# EasyEDA Pro project ProProject_007aLS_2024-05-12.epro

# Schematic Schematic1.1
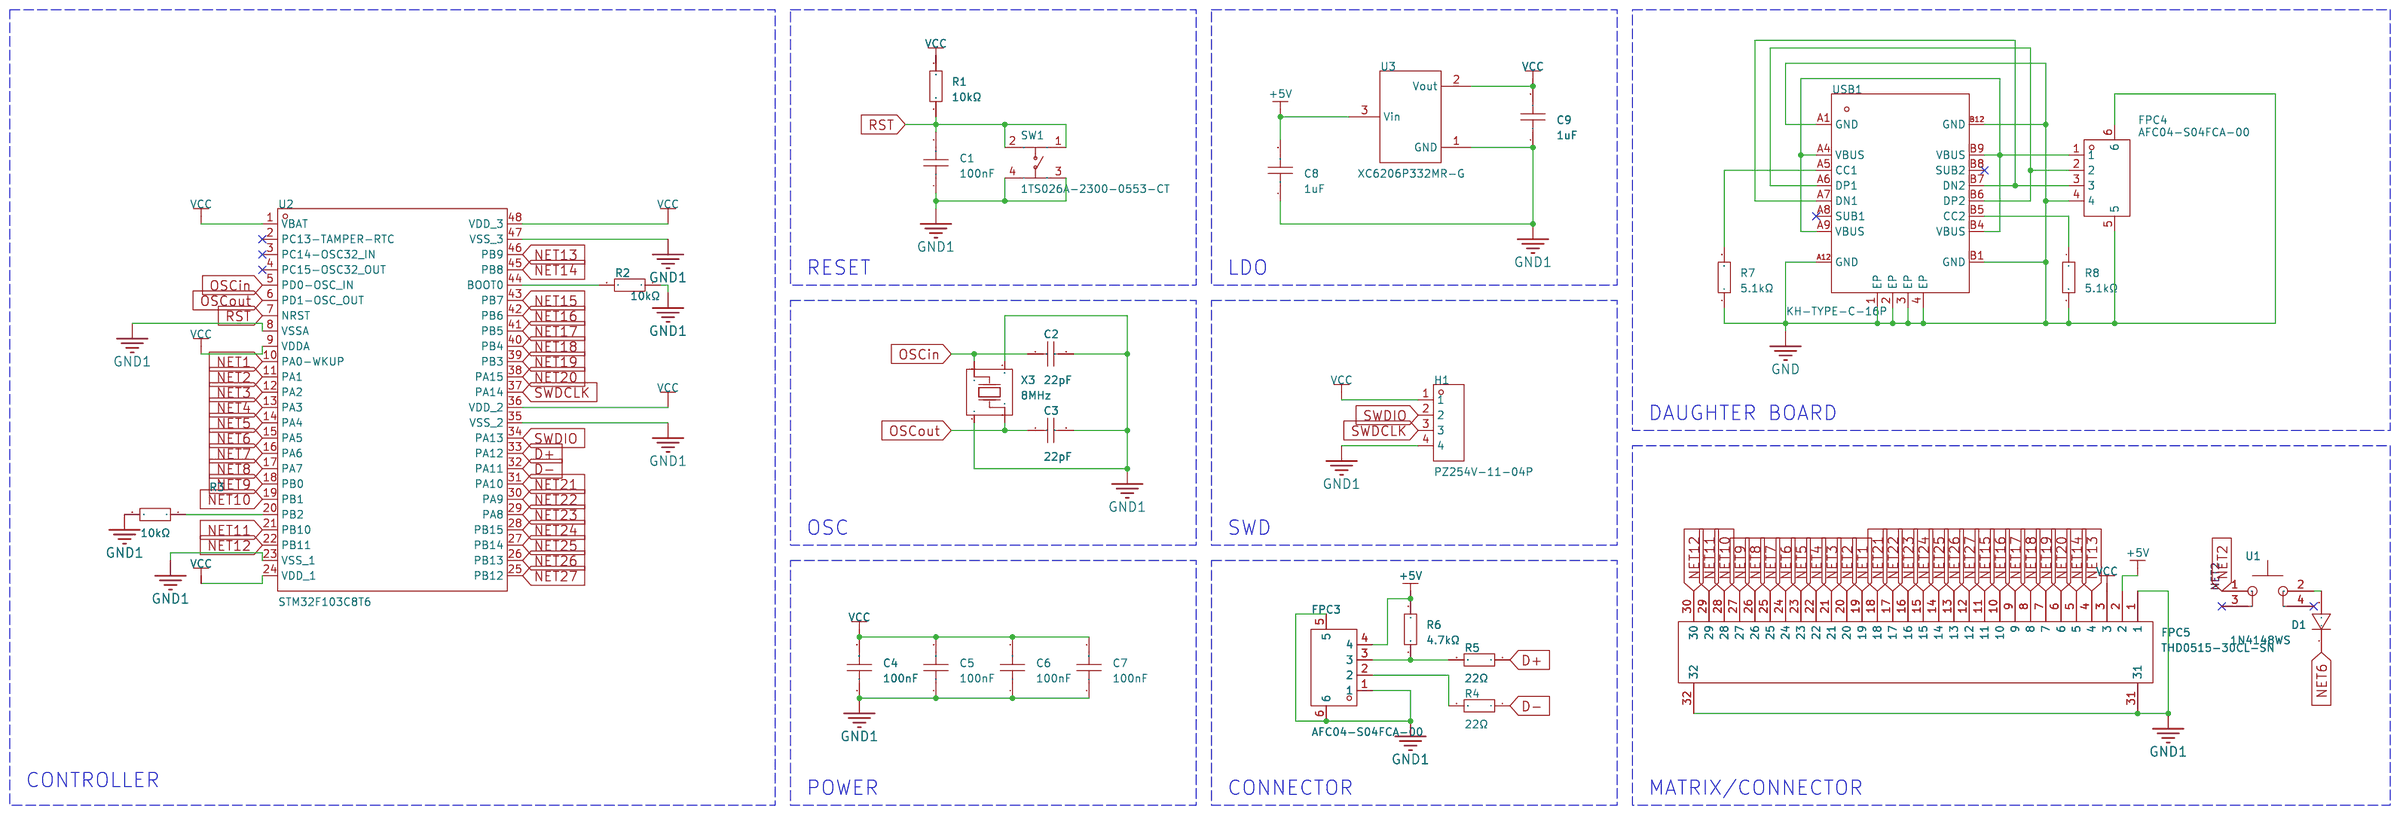
[diagram p0: schematic sheet]

## Parts
C1  100nF  [C0603]
C2  22pF  [C0603]
C3  22pF  [C0603]
C4  100nF  [C0603]
C5  100nF  [C0603]
C6  100nF  [C0603]
C7  100nF  [C0603]
C8  1uF  [C0603]
C9  1uF  [C0603]
D1  1N4148WS  [SOD-323_L1.8-W1.3-LS2.5-RD]
FPC3  AFC04-S04FCA-00  [FPC-SMD_AFC04-S04FCA-00]
FPC4  AFC04-S04FCA-00  [FPC-SMD_AFC04-S04FCA-00]
FPC5  THD0515-30CL-SN  [FFC-SMD_30P-P0.50_THD0515-30CL-SN]
H1  PZ254V-11-04P  [HDR-TH_4P-P2.54-V-M]
R1  10kΩ  [R0603]
R2  10kΩ  [R0603]
R3  10kΩ  [R0603]
R4  22Ω  [R0603]
R5  22Ω  [R0603]
R6  4.7kΩ  [R0603]
R7  5.1kΩ  [R0603]
R8  5.1kΩ  [R0603]
SW1  1TS026A-2300-0553-CT  [SW-SMD_4P-L2.6-W1.6-P0.75-LS3.0]
U1  -  [MXOnly-6.25U/7U-Hotswap-ReversedStabilizers]
U2  STM32F103C8T6  [LQFP-48_L7.0-W7.0-P0.50-LS9.0-BL]
U3  XC6206P332MR-G  [SOT-23-3_L2.9-W1.6-P1.90-LS2.8-BR]
USB1  KH-TYPE-C-16P  [USB-C-SMD_KH-TYPE-C-16P]
X3  8MHz  [OSC-SMD_4P-L3.2-W2.5-BL]

## Library data of the parts
C1 C4-C7 = CC0603KRX7R9BB104: 容值:100nF;精度:±10%;额定电压:50V;材质(温度系数):X7R;; LCSC Part Name: 100nF ±10% 50V; Supplier Part: C14663; Manufacturer: YAGEO(国巨); Supplier Footprint: 0603; JLCPCB Part Class: 基础库; Datasheet: https://atta.szlcsc.com/upload/public/pdf/source/20180910/C282072_33301C7F631E79921B82A8DAC6BCC5B3.pdf; Supplier: LCSC; Tolerance: ±10%; Voltage Rated: 50V; Temperature Coefficient: X7R
C2 C3 = CL10C220JB8NNNC: 容值:22pF;精度:±5%;额定电压:50V;材质(温度系数):C0G;; LCSC Part Name: 22pF ±5% 50V; Supplier Part: C1653; Manufacturer: SAMSUNG(三星); Supplier Footprint: 0603; JLCPCB Part Class: 基础库; Datasheet: https://atta.szlcsc.com/upload/public/pdf/source/20160218/1457707763339.pdf; Supplier: LCSC; Tolerance: ±5%; Voltage Rated: 50V; Temperature Coefficient: C0G
C8 C9 = CL10A105KB8NNNC: 容值:1uF;精度:±10%;额定电压:50V;材质(温度系数):X5R;; LCSC Part Name: 1uF ±10% 50V; Supplier Part: C15849; Manufacturer: SAMSUNG(三星); Supplier Footprint: 0603; JLCPCB Part Class: 基础库; Datasheet: https://atta.szlcsc.com/upload/public/pdf/source/20160218/1457707763339.pdf; Supplier: LCSC; Tolerance: ±10%; Voltage Rated: 50V; Temperature Coefficient: X5R
D1 = 1N4148WS_C2128: 二极管配置:独立式;正向压降(Vf):1.25V@150mA;直流反向耐压(Vr):100V;平均整流电流(Io):150mA;功率:200mW;反向恢复时间(trr):4ns;; LCSC Part Name: 电压:100V 电流:150mA; Supplier Part: C2128; Manufacturer: CJ(江苏长电/长晶); Supplier Footprint: SOD-323; JLCPCB Part Class: 基础库; Datasheet: https://atta.szlcsc.com/upload/public/pdf/source/20140809/1457707208178.pdf; Supplier: LCSC; Diode Configuration: 独立式; Forward Voltage (Vf@If): 1.25V@150mA; Reverse Voltage (Vr): 100V; Average Rectified Current (Io): 150mA; Power Dissipation: 200mW; Reverse Leakage Current: 1uA@75V; Reverse Recovery Time (trr): 4ns
FPC3 FPC4 = AFC04-S04FCA-00: 锁定特性:抽屉式;触点类型:下接;触点数量:4P;间距:0.5mm;安装类型:卧贴;工作温度范围:-25℃~+85℃;; LCSC Part Name: 间距:0.5mm P数:4P 抽屉式 下接; Supplier Part: C883623; Manufacturer: JS(钜硕电子); Supplier Footprint: SMD,P=0.5mm,卧贴; JLCPCB Part Class: 扩展库; Datasheet: https://atta.szlcsc.com/upload/public/pdf/source/20201020/C883623_C1266E0D076E1742B421A6F99EE675B6.pdf; Supplier: LCSC; Locking Feature: 抽屉式; Contact Type: 下接; Number of Contacts: 4P; Pitch: 0.5mm; Mounting Type: 卧贴; FFC, FCB Thickness: 0.3mm; Height Above Board: 1.2mm; Operating Temperature Range: -25℃~+85℃
FPC5 = THD0515-30CL-SN: 锁定特性:翻盖式;触点类型:下接;触点数量:30P;间距:0.5mm;安装类型:卧贴;; LCSC Part Name: 间距:0.5mm P数:30P 翻盖式 下接; Supplier Part: C283152; Manufacturer: THD(台华达); Supplier Footprint: SMD,P=0.5mm,卧贴; JLCPCB Part Class: 扩展库; Datasheet: https://atta.szlcsc.com/upload/public/pdf/source/20191217/C473757_20968A8B43F39FFA96CE4CB8A2D46C0F.pdf; Supplier: LCSC; Locking Feature: 翻盖式; Contact Type: 下接; Number of Contacts: 30P; Pitch: 0.5mm; Mounting Type: 卧贴; FFC, FCB Thickness: 0.3mm; Height Above Board: 1.5mm
H1 = PZ254V-11-04P: 插针结构:1x4P;间距:2.54mm;行距:-;圆针/方针:方针;安装类型:直插;排数:单排;总PIN位数:4P;额定电流:3A;额定电压:250V;配合针长度:6mm;塑高:2.5mm;端接针长度:3mm;触头材质:-;工作温度范围:-40℃~+105℃;颜色:黑色;; LCSC Part Name: 间距:2.54mm 1x4P 直插 方针; Supplier Part: C2691448; Manufacturer: XFCN(兴飞); Supplier Footprint: 插件,P=2.54mm; JLCPCB Part Class: 扩展库; Datasheet: https://atta.szlcsc.com/upload/public/pdf/source/20200309/C492403_F9F19131791D08044AD4F84F8E751A34.pdf; Supplier: LCSC; Pin Structure: 1x4P; Pitch: 2.54mm; Circluar Pins/Square Pins: 方针; Mounting Type: 直插; Number of Rows: 单排; Number of Pins: 4P; Current Rating (Max): 3A; Voltage Rating (Max): 250V; Length of Mating Pin: 6mm; Insulation Height: 2.5mm; Length of End Connection Pin: 3mm; Operating Temperature Range: -40℃~+105℃; Color: 黑色
R1-R3 = 0603WAF1002T5E: 电阻类型:厚膜电阻;阻值:10kΩ;精度:±1%;功率:100mW;最大工作电压:75V;温度系数:±100ppm/℃;; LCSC Part Name: 厚膜电阻 10kΩ ±1% 100mW; Supplier Part: C25804; Manufacturer: UNI-ROYAL(厚声); Supplier Footprint: 0603; JLCPCB Part Class: 基础库; Datasheet: https://atta.szlcsc.com/upload/public/pdf/source/20200306/C422600_1E6D84923E4A46A82E41ADD87F860B5C.pdf; Supplier: LCSC; Type: 厚膜电阻; Tolerance: ±1%; Power(Watts): 100mW; Overload Voltage (Max): 75V; Temperature Coefficient: ±100ppm/℃; Operating Temperature Range: -55℃~+155℃
R4 R5 = 0603WAF220JT5E: 电阻类型:厚膜电阻;阻值:22Ω;精度:±1%;功率:100mW;最大工作电压:75V;温度系数:±100ppm/℃;; LCSC Part Name: 22Ω ±1% 100mW 厚膜电阻; Supplier Part: C23345; Manufacturer: UNI-ROYAL(厚声); Supplier Footprint: 0603; JLCPCB Part Class: 基础库; Datasheet: https://atta.szlcsc.com/upload/public/pdf/source/20200306/C422600_1E6D84923E4A46A82E41ADD87F860B5C.pdf; Supplier: LCSC; Type: 厚膜电阻; Tolerance: ±1%; Power(Watts): 100mW; Overload Voltage (Max): 75V; Temperature Coefficient: ±100ppm/℃; Operating Temperature Range: -55℃~+155℃
R6 = 0603WAF4701T5E: 电阻类型:厚膜电阻;阻值:4.7kΩ;精度:±1%;功率:100mW;最大工作电压:75V;温度系数:±100ppm/℃;; LCSC Part Name: 4.7kΩ ±1% 100mW 厚膜电阻; Supplier Part: C23162; Manufacturer: UNI-ROYAL(厚声); Supplier Footprint: 0603; JLCPCB Part Class: 基础库; Datasheet: https://atta.szlcsc.com/upload/public/pdf/source/20200306/C422600_1E6D84923E4A46A82E41ADD87F860B5C.pdf; Supplier: LCSC; Type: 厚膜电阻; Tolerance: ±1%; Power(Watts): 100mW; Overload Voltage (Max): 75V; Temperature Coefficient: ±100ppm/℃; Operating Temperature Range: -55℃~+155℃
R7 R8 = 0603WAF5101T5E: 电阻类型:厚膜电阻;阻值:5.1kΩ;精度:±1%;功率:100mW;最大工作电压:75V;温度系数:±100ppm/℃;; LCSC Part Name: 5.1kΩ ±1% 100mW 厚膜电阻; Supplier Part: C23186; Manufacturer: UNI-ROYAL(厚声); Supplier Footprint: 0603; JLCPCB Part Class: 基础库; Datasheet: https://atta.szlcsc.com/upload/public/pdf/source/20200306/C422600_1E6D84923E4A46A82E41ADD87F860B5C.pdf; Supplier: LCSC; Type: 厚膜电阻; Tolerance: ±1%; Power(Watts): 100mW; Overload Voltage (Max): 75V; Temperature Coefficient: ±100ppm/℃; Operating Temperature Range: -55℃~+155℃
SW1 = 1TS026A-2300-0553-CT: 电路结构:单刀单掷;按钮形状:圆形按钮;作用力:230gf;安装方式:立贴;开关长度:2.6mm;开关宽度:1.6mm;开关高度:0.55mm;带支架:不带;触点电流:50mA;额定电压(DC):12V;额定功率:0.6W;绝缘电阻:100MΩ;带灯:无;机械寿命:20万次;; LCSC Part Name: 2.6*1.6*0.55mm 立贴 轻触开关; Supplier Part: C913791; Manufacturer: HYP(鸿源精密); Supplier Footprint: SMD,1.6x2.6mm; JLCPCB Part Class: 扩展库; Datasheet: https://atta.szlcsc.com/upload/public/pdf/source/20210419/C913791_AF3AAAEB1C89AA41BE379EDBB7CBA7E3.pdf; Supplier: LCSC; Circuit: 单刀单掷; Actuator Style: 圆形按钮; Operating Force: 230gf; Mounting Style: 立贴; Switch Length: 2.6mm; Switch Width: 1.6mm; Switch Height: 0.55mm; Strike Gundam: 不带; Contact Current: 50mA; Voltage Rating (DC): 12V; Power Rating: 0.6W; Insulation Resistance: 100MΩ; Actuator/Cap Color: 黑色; With Lamp: 无; IP Rating: IP68; Pin Style: SMD接片; Mechanical Life: 20万次; Operating Temperature: -40℃~+90℃
U1 = MXOnly-6.25U/7U-Hotswap-ReversedStabilizers
U2 = STM32F103C8T6: CPU内核:CM3;程序存储容量:64KB;RAM总容量:20KB;GPIO端口数量:37;工作电压范围:2V~3.6V;CPU最大主频:72MHz;程序存储器类型:FLASH;; LCSC Part Name: STM32F103C8T6 MSL=3; Supplier Part: C8734; Manufacturer: ST(意法半导体); Supplier Footprint: LQFP-48(7x7); Datasheet: https://atta.szlcsc.com/upload/public/pdf/source/20220812/8363ACEC51AD55ECEB84799464F7CB85.pdf; Supplier: LCSC; CPU Core: CM3; Program Storage Size: 64KB; RAM Size: 20KB; GPIO Ports Number: 37; Operating Voltage Range: 2V~3.6V; CPU Maximum Speed: 72MHz; Program Memory Type: FLASH; Operating Temperature Range: -40℃~+85℃; ADC (Bit): 12bit; Universal Serial Bus: 有; Peripheral/Function: 看门狗；DMA；看门狗；片载温度传感器; Watchdog: 有; Infrared Data Association: 有; Low-Voltage Detect: 有; Direct Memory Access: 有; Internal Oscillator: 有
U3 = XC6206P332MR-G_C5446: 输出类型:固定;最大输入电压:6V;输出电压:3.3V;最大输出电流:200mA;电源纹波抑制比(PSRR):-;输出极性:正极;; LCSC Part Name: 输入6V 输出3.3V 200mA; Supplier Part: C5446; Manufacturer: TOREX(特瑞仕); Supplier Footprint: SOT-23-3L; JLCPCB Part Class: 基础库; Datasheet: https://atta.szlcsc.com/upload/public/pdf/source/20130823/1457706639850.pdf; Supplier: LCSC; Output Type: 固定; Maximum Input Voltage: 6V; Output Voltage: 3.3V; MAX Output Current: 200mA; Dropout Voltage: 680mV@(100mA); Output Polarity: 正极; Number of Outputs: 1
USB1 = KH-TYPE-C-16P: 连接器类型:Type-C;标准:-;公母:母;端口数量:1;触点数量:16P;安装方式:卧贴;额定电流 - 电源:3A;工作温度范围:-40℃~+85℃;; LCSC Part Name: Type-C 母 卧贴; Supplier Part: C709357; Manufacturer: kinghelm(金航标); Supplier Footprint: SMD; JLCPCB Part Class: 扩展库; Datasheet: https://atta.szlcsc.com/upload/public/pdf/source/20200911/C709357_AA8DCEB38BB20E3035A7ED7AE7667837.pdf; Supplier: LCSC; Connector Type: Type-C; Gender: 母; Number of Ports: 1; Number of Contacts: 16P; Mounting Style: 卧贴; Current Rating - Power (Max): 3A; Operating Temperature Range: -40℃~+85℃
X3 = TAXM8M4RDBCCT2T: 晶振类型:贴片晶振;频率:8MHz;常温频差:±10ppm;外接负载电容:10pF;频率稳定度(全温):±15ppm;; LCSC Part Name: 8MHz ±10ppm 10pF; Supplier Part: C400090; Manufacturer: YJX(雅晶鑫); Supplier Footprint: SMD3225-4P; JLCPCB Part Class: 扩展库; Datasheet: https://atta.szlcsc.com/upload/public/pdf/source/20190626/C400090_CF95B89E745AFE4EF2E392EF8AC009D6.pdf; Supplier: LCSC; Crystal Type: 贴片晶振; Normal temperature Frequency Tolerance: ±10ppm; External load capacitor: 10pF; Frequency Stability(Full temperature range): ±15ppm; Equivalent Series Resistance (ESR): 250Ω; Operating Temperature: -40℃~+85℃

## Nets
+5V: C8.2 FPC3.4 FPC5.2 R6.2 U3.3(Vin)
GND: FPC4.4 FPC4.5 FPC4.6 R7.1 R8.2 USB1.1(EP) USB1.2(EP) USB1.3(EP) USB1.4(EP) USB1.A1(GND) USB1.A12(GND) USB1.B1(GND) USB1.B12(GND)
GND1: C1.1 C2.2 C3.2 C4.1 C5.1 C6.1 C7.1 C8.1 C9.1 FPC3.1 FPC3.5 FPC3.6 FPC5.1 FPC5.31 FPC5.32 H1.4 R2.1 R3.2 SW1.3 SW1.4 U2.8(VSSA) U2.23(VSS_1) U2.35(VSS_2) U2.47(VSS_3) U3.1(GND) X3.2 X3.4
VBUS: FPC4.1 USB1.A4(VBUS) USB1.A9(VBUS) USB1.B4(VBUS) USB1.B9(VBUS)
VCC: C4.2 C5.2 C6.2 C7.2 C9.2 FPC5.3 H1.1 R1.2 U2.1(VBAT) U2.9(VDDA) U2.24(VDD_1) U2.36(VDD_2) U2.48(VDD_3) U3.2(Vout)
BOOT0: R2.2 U2.44(BOOT0)
BOOT1: R3.1 U2.20(PB2)
CC1: R7.2 USB1.A5(CC1)
CC2: R8.1 USB1.B5(CC2)
D+: R5.1 U2.33(PA12)
D-: R4.1 U2.32(PA11)
DN: FPC4.3 USB1.A7(DN1) USB1.B7(DN2)
DP: FPC4.2 USB1.A6(DP1) USB1.B6(DP2)
NET1: FPC5.19 U2.10(PA0-WKUP)
NET2: FPC5.20 U1.1 U2.11(PA1)
NET3: FPC5.21 U2.12(PA2)
NET4: FPC5.22 U2.13(PA3)
NET5: FPC5.23 U2.14(PA4)
NET6: D1.1(K) FPC5.24 U2.15(PA5)
NET7: FPC5.25 U2.16(PA6)
NET8: FPC5.26 U2.17(PA7)
NET9: FPC5.27 U2.18(PB0)
NET10: FPC5.28 U2.19(PB1)
NET11: FPC5.29 U2.21(PB10)
NET12: FPC5.30 U2.22(PB11)
NET13: FPC5.4 U2.46(PB9)
NET14: FPC5.5 U2.45(PB8)
NET15: FPC5.11 U2.43(PB7)
NET16: FPC5.10 U2.42(PB6)
NET17: FPC5.9 U2.41(PB5)
NET18: FPC5.8 U2.40(PB4)
NET19: FPC5.7 U2.39(PB3)
NET20: FPC5.6 U2.38(PA15)
NET21: FPC5.18 U2.31(PA10)
NET22: FPC5.17 U2.30(PA9)
NET23: FPC5.16 U2.29(PA8)
NET24: FPC5.15 U2.28(PB15)
NET25: FPC5.14 U2.27(PB14)
NET26: FPC5.13 U2.26(PB13)
NET27: FPC5.12 U2.25(PB12)
OSCin: C2.1 U2.5(PD0-OSC_IN) X3.3
OSCout: C3.1 U2.6(PD1-OSC_OUT) X3.1
PRED+: FPC3.3 R5.2 R6.1
PRED-: FPC3.2 R4.2
RST: C1.2 R1.1 SW1.1 SW1.2 U2.7(NRST)
SWDCLK: H1.3 U2.37(PA14)
SWDIO: H1.2 U2.34(PA13)
$1N22067: D1.2(A) U1.2

Not connected (* = marked no-connect by the designer): U1 3* 4*; U2 2(PC13-TAMPER-RTC)* 3(PC14-OSC32_IN)* 4(PC15-OSC32_OUT)*; USB1 A8(SUB1)* B8(SUB2)*

## Notes on the sheet
- RESET
- LDO
- DAUGHTER BOARD
- OSC
- SWD
- CONTROLLER
- POWER
- CONNECTOR
- MATRIX/CONNECTOR

# Board PCB1.1
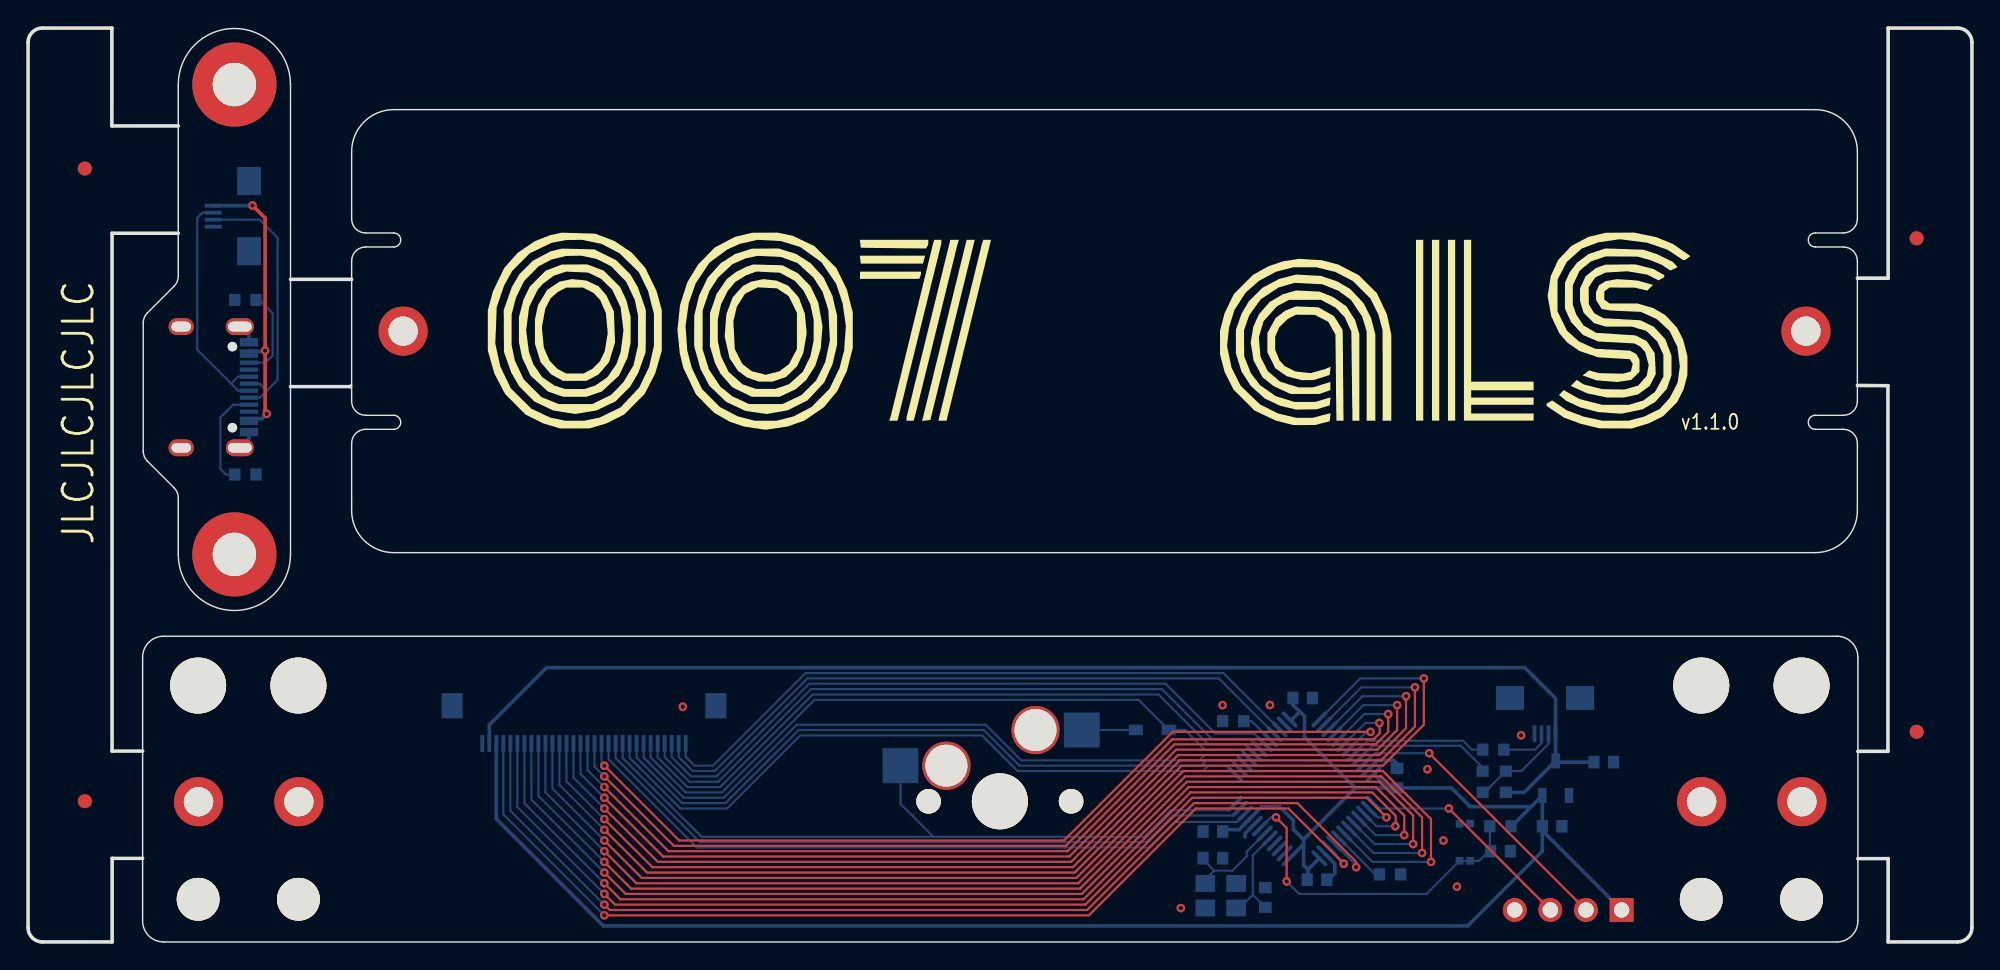
[diagram p1: board, top side]
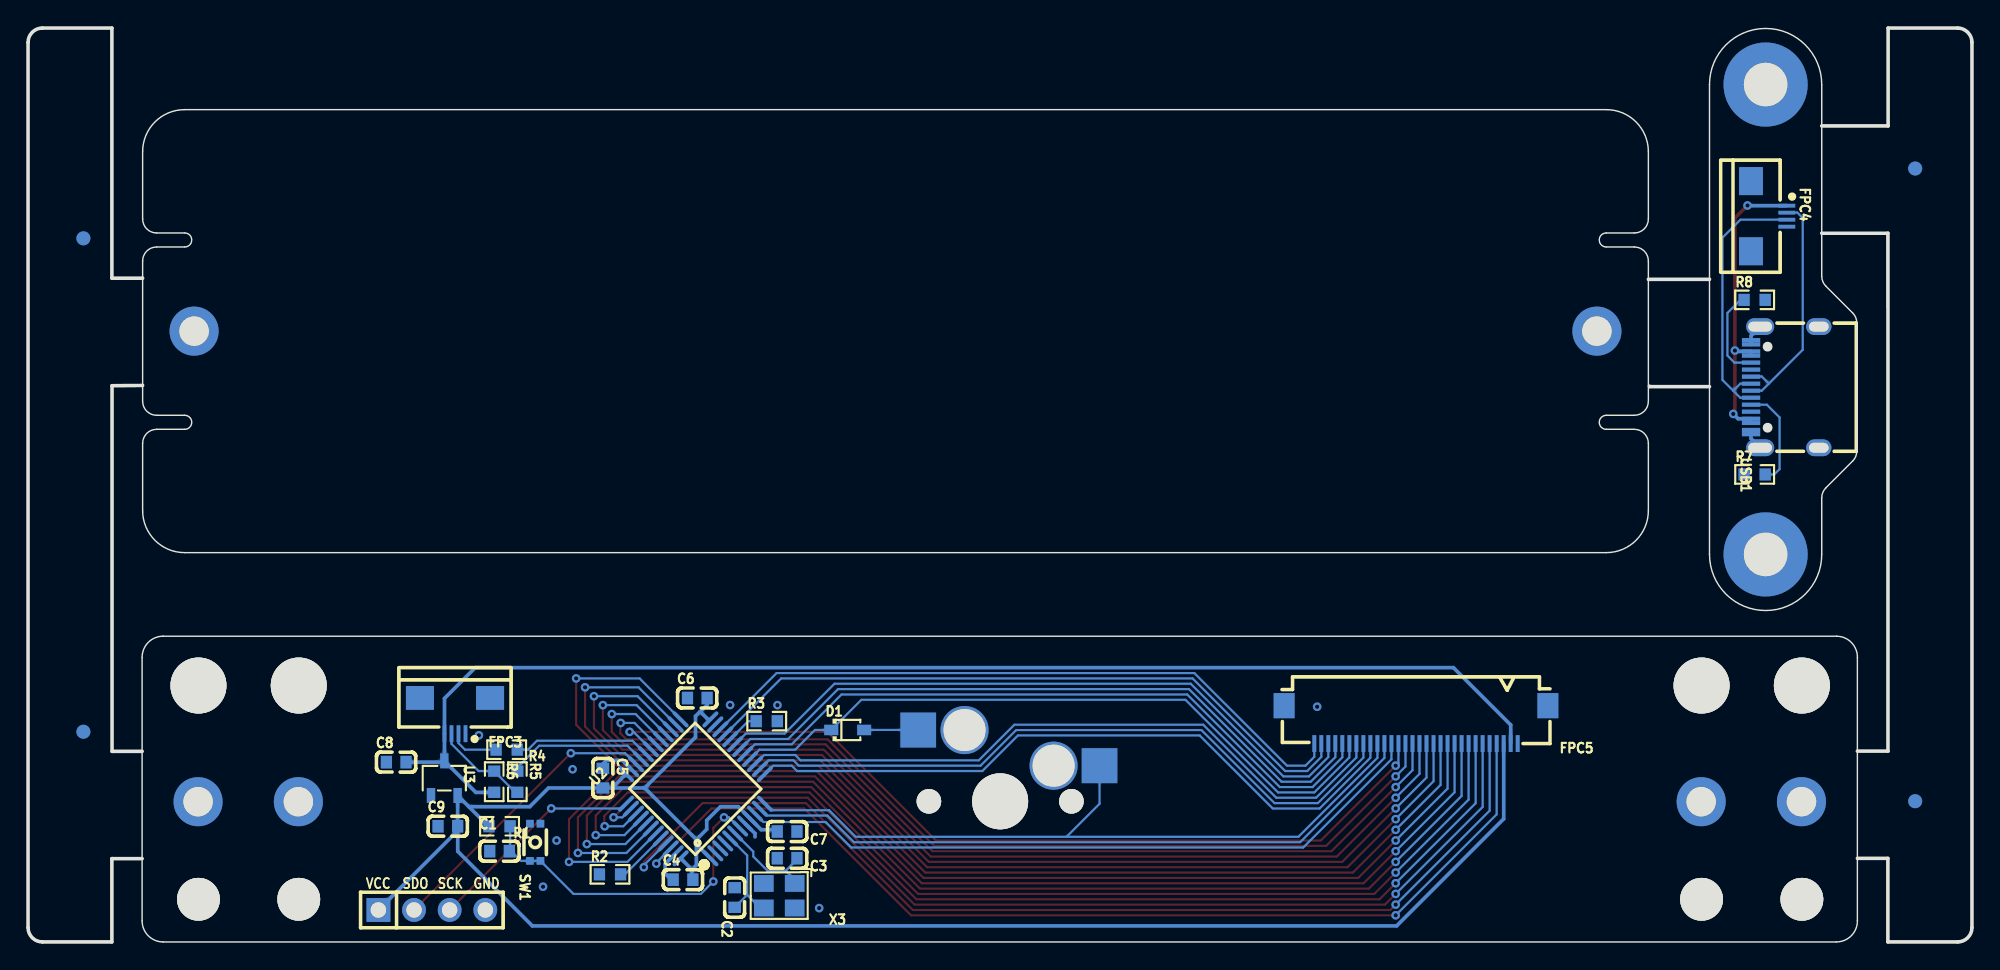
[diagram p2: board, bottom side, seen from below]

Outline 138.57 x 65.16 mm; copper layers: Top Layer, Bottom Layer. Coordinates in mm from the lower left corner of the outline.
Outline path: 10.71,50.53 5.99,50.53 5.99,13.61 8.17,13.61 ; 8.17,5.96 5.99,5.96 5.99,0 1.02,0 arc(0.3,0.3) 0,1.03 0,64.14 arc(0.3,64.86) 1.02,65.16 5.98,65.16 5.98,58.18 10.71,58.18 ; 18.71,47.24 23.07,47.24 ; 18.71,39.59 22.96,39.59 22.99,39.63 ; 130.4,39.68 132.58,39.66 132.58,13.59 130.44,13.59 ; 130.44,5.94 132.6,5.94 132.6,0 137.55,0 arc(138.27,0.3) 138.57,1.03 138.57,64.14 arc(138.27,64.86) 137.55,65.16 132.6,65.16 132.6,47.33 130.4,47.33 ; 8.17,20.3 8.17,1.5 arc(8.6,0.44) 9.67,0 128.94,0 arc(130,0.44) 130.44,1.5 130.44,20.3 arc(130,21.36) 128.94,21.8 9.67,21.8 arc(8.6,21.36) 8.17,20.3 ; 8.21,44.14 arc(8.28,44.52) 8.5,44.85 10.42,46.76 arc(10.63,47.08) 10.71,47.47 10.71,61.13 arc(14.71,65.13) 18.71,61.13 18.71,27.63 arc(14.71,23.63) 10.71,27.63 10.71,31.67 arc(10.63,32.05) 10.42,32.37 8.5,34.29 arc(8.28,34.61) 8.21,34.99 8.21,44.14 ; 23.07,56.34 arc(23.95,58.46) 26.07,59.34 127.4,59.34 arc(129.53,58.46) 130.4,56.34 130.4,51.55 arc(130.11,50.84) 129.4,50.55 127.4,50.55 arc(126.9,50.05) 127.4,49.55 129.4,49.55 arc(130.11,49.26) 130.4,48.55 130.4,38.55 arc(130.11,37.84) 129.4,37.55 127.4,37.55 arc(126.9,37.05) 127.4,36.55 129.4,36.55 arc(130.11,36.26) 130.4,35.55 130.4,30.76 arc(129.53,28.64) 127.4,27.76 26.07,27.76 arc(23.95,28.64) 23.07,30.76 23.07,35.55 arc(23.36,36.26) 24.07,36.55 26.07,36.55 arc(26.57,37.05) 26.07,37.55 24.07,37.55 arc(23.36,37.84) 23.07,38.55 23.07,48.55 arc(23.36,49.26) 24.07,49.55 26.07,49.55 arc(26.57,50.05) 26.07,50.55 24.07,50.55 arc(23.36,50.84) 23.07,51.55 23.07,56.34
Stack: Top Layer 0.035mm / Dielectric1 1.51mm FR4 er 4.5 / Bottom Layer 0.035mm

## Design rules (mm)
template: JLCPCB Capability(Two Layers Board)
spacing copperThickness1oz (default): track to track 0.102, other pairs 0.152 to 0.3
spacing copperThickness2oz: track to track 0.203, other pairs 0.152 to 0.3
track width copperThickness1oz (default): min 0.127, default 0.254, max 2.54
track width copperThickness2oz: min 0.203, default 0.254, max 2.54
differential pair differentialPair (default): width min 0.127, default 0.254, max 2.54; gap min 0.152, default 0.152
via viaSize (default): diameter min 0.5, default 0.61, max 10; hole min 0.3, default 0.305, max 6.3

## Placement (name value [footprint] x y rotation side)
C1  100nF  [C0603]  104.96 6.47 180 bottom
C2  22pF  [C0603]  88.2 3.17 90 bottom
C3  22pF  [C0603]  84.46 5.97 0 bottom
C4  100nF  [C0603]  91.88 4.44 180 bottom
C5  100nF  [C0603]  97.6 11.68 270 bottom
C6  100nF  [C0603]  90.86 17.39 180 bottom
C7  100nF  [C0603]  84.46 7.88 0 bottom
C8  1uF  [C0603]  112.33 12.82 180 bottom
C9  1uF  [C0603]  108.64 8.25 180 bottom
D1  1N4148WS  [SOD-323_L1.8-W1.3-LS2.5-RD]  80.14 15.11 180 bottom
FPC3  AFC04-S04FCA-00  [FPC-SMD_AFC04-S04FCA-00]  108.14 16.12 0 bottom
FPC4  AFC04-S04FCA-00  [FPC-SMD_AFC04-S04FCA-00]  14.47 51.75 270 bottom
FPC5  THD0515-30CL-SN  [FFC-SMD_30P-P0.50_THD0515-30CL-SN]  39.63 15.5 0 bottom
H1  PZ254V-11-04P  [HDR-TH_4P-P2.54-V-M]  109.79 2.28 180 bottom
NOREF  -  [Pad_e1461]  126.45 10 0 top
NOREF#2  -  [Pad_e265]  26.74 43.55 0 top
NOREF#3  -  [Pad_e2086]  134.63 50.17 0 top
NOREF#4  -  [Pad_e2041]  4.05 10.03 0 top
NOREF#5  -  [Pad_e2039]  134.63 50.17 0 top
NOREF#6  -  [Pad_e1462]  12.15 10 0 top
NOREF#7  -  [Pad_e2087]  134.63 14.99 0 top
NOREF#8  -  [Pad_e2085]  4.05 10.03 0 top
NOREF#9  -  [Pad_e1045]  14.71 27.63 90 top
NOREF#10  -  [Pad_e2034]  4.05 55.14 0 top
NOREF#11  -  [Pad_e1046]  14.71 61.13 90 top
NOREF#12  -  [Pad_e2088]  4.05 55.14 0 top
NOREF#13  -  [Pad_e2040]  134.63 14.99 0 top
NOREF#14  -  [Pad_e1460]  119.3 10 0 top
NOREF#15  -  [Pad_e1463]  19.3 10 0 top
NOREF#16  -  [Pad_e266]  126.74 43.55 0 top
R1  10kΩ  [R0603]  104.96 8.25 0 bottom
R2  10kΩ  [R0603]  97.09 4.82 180 bottom
R3  10kΩ  [R0603]  85.91 15.74 180 bottom
R4  22Ω  [R0603]  104.45 13.71 0 bottom
R5  22Ω  [R0603]  103.69 11.42 270 bottom
R6  4.7kΩ  [R0603]  105.34 11.42 270 bottom
R7  5.1kΩ  [R0603]  15.49 33.33 180 bottom
R8  5.1kΩ  [R0603]  15.49 45.78 180 bottom
SW1  1TS026A-2300-0553-CT  [SW-SMD_4P-L2.6-W1.6-P0.75-LS3.0]  102.42 7.11 90 bottom
U1  -  [MXOnly-6.25U/7U-Hotswap-ReversedStabilizers]  69.28 10.03 0 top
U2  STM32F103C8T6  [LQFP-48_L7.0-W7.0-P0.50-LS9.0-BL]  90.99 10.92 135 bottom
U3  XC6206P332MR-G  [SOT-23-3_L2.9-W1.6-P1.90-LS2.8-BR]  108.9 11.68 270 bottom
USB1  KH-TYPE-C-16P  [USB-C-SMD_KH-TYPE-C-16P]  13.33 39.55 90 bottom
X3  8MHz  [OSC-SMD_4P-L3.2-W2.5-BL]  85.02 3.3 0 bottom

## Footprints (pads in the part's own frame, mm; a bottom-side part is the same pattern mirrored in y, then rotated)
C0603
  rect 0.8x0.9 smd: 1(-0.7,0) 2(0.7,0)
FFC-SMD_30P-P0.50_THD0515-30CL-SN
  rect 0.28x1.2 smd: 1(-7.25,1.35) 2(-6.75,1.35) 3(-6.25,1.35) 4(-5.75,1.35) 5(-5.25,1.35) 6(-4.75,1.35) 7(-4.25,1.35) 8(-3.75,1.35) 9(-3.25,1.35) 10(-2.75,1.35) 11(-2.25,1.35) 12(-1.75,1.35) 13(-1.25,1.35) 14(-0.75,1.35) 15(-0.25,1.35) 16(0.25,1.35) 17(0.75,1.35) 18(1.25,1.35) 19(1.75,1.35) 20(2.25,1.35) 21(2.75,1.35) 22(3.25,1.35) 23(3.75,1.35) 24(4.25,1.35) 25(4.75,1.35) 26(5.25,1.35) 27(5.75,1.35) 28(6.25,1.35) 29(6.75,1.35) 30(7.25,1.35)
  rect 1.5x1.8 smd: 31(9.4,-1.35) 32(-9.4,-1.35)
FPC-SMD_AFC04-S04FCA-00
  rect 0.27x1.2 smd: 1(-0.75,1.275) 2(-0.249,1.275) 3(0.251,1.275) 4(0.75,1.275)
  rect 2x1.7 smd: 5(2.5,-1.275) 6(-2.5,-1.275)
HDR-TH_4P-P2.54-V-M
  rect 1.7x1.7 hole 1.1: 1(-3.81,0)
  round 1.7 hole 1.1: 2(-1.27,0) 3(1.27,0) 4(3.81,0)
LQFP-48_L7.0-W7.0-P0.50-LS9.0-BL
  oval 0.27x1.5 smd: 1(-2.75,-4.25) 2(-2.25,-4.25) 3(-1.75,-4.25) 4(-1.25,-4.25) 5(-0.75,-4.25) 6(-0.25,-4.25) 7(0.25,-4.25) 8(0.75,-4.25) 9(1.25,-4.25) 10(1.75,-4.25) 11(2.25,-4.25) 12(2.75,-4.25) 25(2.75,4.25) 26(2.25,4.25) 27(1.75,4.25) 28(1.25,4.25) 29(0.75,4.25) 30(0.25,4.25) 31(-0.25,4.25) 32(-0.75,4.25) 33(-1.25,4.25) 34(-1.75,4.25) 35(-2.25,4.25) 36(-2.75,4.25)
  oval 1.5x0.27 smd: 13(4.25,-2.75) 14(4.25,-2.25) 15(4.25,-1.75) 16(4.25,-1.25) 17(4.25,-0.75) 18(4.25,-0.25) 19(4.25,0.25) 20(4.25,0.75) 21(4.25,1.25) 22(4.25,1.75) 23(4.25,2.25) 24(4.25,2.75) 37(-4.25,2.75) 38(-4.25,2.25) 39(-4.25,1.75) 40(-4.25,1.25) 41(-4.25,0.75) 42(-4.25,0.25) 43(-4.25,-0.25) 44(-4.25,-0.75) 45(-4.25,-1.25) 46(-4.25,-1.75) 47(-4.25,-2.25) 48(-4.25,-2.75)
MXOnly-6.25U/7U-Hotswap-ReversedStabilizers
  rect 2.55x2.5 smd far side: 1(-7.085,2.54) 2(5.842,5.08)
  round 3.429 hole 3: 3(-3.81,2.54) 4(2.54,5.08)
  round 3.988 hole 3.988: 5(0,0) 8(-57.15,8.255) 9(-50,8.255) 10(50,8.255) 11(57.15,8.255)
  round 1.75 hole 1.75: 6(-5.08,0) 7(5.08,0)
  round 3.048 hole 3.048: 12(-57.15,-6.985) 13(-50,-6.985) 14(50,-6.985) 15(57.15,-6.985)
OSC-SMD_4P-L3.2-W2.5-BL
  rect 1.4x1.2 smd: 1(-1.1,-0.875) 2(1.1,-0.875) 3(1.1,0.875) 4(-1.1,0.875)
Pad_e265
  round 3.5 hole 2.1: 54(0,0)
Pad_e266
  round 3.5 hole 2.1: 54(0,0)
Pad_e1045
  round 6 hole 3.1: 49(0,0)
Pad_e1046
  round 6 hole 3.1: 50(0,0)
Pad_e1460
  round 3.5 hole 2.1: 51(0,0)
Pad_e1461
  round 3.5 hole 2.1: 52(0,0)
Pad_e1462
  round 3.5 hole 2.1: 53(0,0)
Pad_e1463
  round 3.5 hole 2.1: 54(0,0)
Pad_e2034
  round 1 smd: 55(0,0)
Pad_e2039
  round 1 smd: 55(0,0)
Pad_e2040
  round 1 smd: 55(0,0)
Pad_e2041
  round 1 smd: 55(0,0)
Pad_e2085
  round 1 smd far side: 55(0,0)
Pad_e2086
  round 1 smd far side: 55(0,0)
Pad_e2087
  round 1 smd far side: 55(0,0)
Pad_e2088
  round 1 smd far side: 55(0,0)
R0603
  rect 0.806x0.864 smd: 1(-0.753,0) 2(0.753,0)
SOD-323_L1.8-W1.3-LS2.5-RD
  rect 1x0.75 smd: 1(-1.173,0) 2(1.173,0)
SOT-23-3_L2.9-W1.6-P1.90-LS2.8-BR
  rect 1.07x0.6 smd: 1(1.235,-0.95) 2(1.235,0.95) 3(-1.235,0)
SW-SMD_4P-L2.6-W1.6-P0.75-LS3.0
  rect 0.55x0.55 smd: 1(-1.325,0.375) 2(-1.325,-0.375) 3(1.325,0.375) 4(1.325,-0.375)
USB-C-SMD_KH-TYPE-C-16P
  oval 1.2x2 hole 0.7x1.7: 1(-4.32,1.765) 2(4.32,1.765)
  oval 1.2x1.8 hole 0.7x1.4: 3(-4.32,-2.415) 4(4.32,-2.415)
  rect 0.3x1.3 smd: A1(-3.35,2.415) A4(-2.55,2.415) A5(-1.25,2.415) A6(-0.25,2.415) A7(0.25,2.415) A8(1.25,2.415) A9(2.55,2.415) A12(3.35,2.415) B1(3.05,2.415) B4(2.25,2.415) B5(1.75,2.415) B6(0.75,2.415) B7(-0.75,2.415) B8(-1.75,2.415) B9(-2.25,2.415) B12(-3.05,2.415)

## Nets
As in the schematic, except:
GND: FPC4.4 FPC4.5 FPC4.6 NOREF#9.49 NOREF#11.50 R7.1 R8.2 USB1.1 USB1.2 USB1.3 USB1.4 USB1.A1 USB1.A12 USB1.B1 USB1.B12
GND2: NOREF#2.54 NOREF#16.54
NET2: FPC5.20 U2.11
NET3: FPC5.21 U1.1 U2.12
NET6: FPC5.24 U2.15
NET7: D1.1 FPC5.25 U2.16
OSCIN: C2.1 U2.5 X3.3
OSCOUT: C3.1 U2.6 X3.1

Pads without a net: NOREF 52; NOREF#3 55; NOREF#4 55; NOREF#5 55; NOREF#6 53; NOREF#7 55; NOREF#8 55; NOREF#10 55; NOREF#12 55; NOREF#13 55; NOREF#14 51; NOREF#15 54; U1 3 4 5 6 7 8 9 10 11 12 13 14 15; U2 2 3 4; USB1 A8 B8

## Via types
v1: diameter 0.61, hole 0.305, Top Layer to Bottom Layer, 45 vias

## Routing (per net, layer and track width the routed paths; a pad name or vN(x,y) marks a point on that pad's centre or on a via; arc(x,y) is an arc through that point)
+5V: length 91.6
  Bottom Layer w0.254: 32.88,14.22 32.88,15.47 36.96,19.56 106.69,19.56 108.89,17.36 FPC3.4 108.89,12.92 U3.3 ; U3.3 108.99,12.82 111.63,12.82 ; U3.3 106.65,10.66 105.35,10.66 R6.2
GND: length 3.1
  Bottom Layer w0.254: USB1.B1 USB1.A12 15.75,43.22 USB1.2 ; USB1.B12 USB1.A1 15.75,35.88 USB1.1
GND1: length 6.5
  Bottom Layer w0.254: U2.47 93.15,5.57 93.15,4.88 92.58,4.31 ; 95.59,12.33 96.21,12.95 97.34,12.95 97.6,12.69 C5.1 ; 86.75,7.49 86.75,7.73 U2.8
  vias: v1(46.68,16.77) v1(82.18,2.41) v1(85.15,16.89) v1(88.53,16.89) v1(99.76,12.31) v1(100.9,7.23) v1(101.86,3.94) v1(106.43,14.73)
VBUS: length 21.3
  Top Layer w0.254: v1(17.01,37.65) 16.9,37.77 v1(16.9,42.17) 16.9,51.61 v1(16,52.51)
  Bottom Layer w0.254: FPC4.1 15.99,52.5 v1(16,52.51) ; USB1.B4 USB1.A9 16.77,42.1 16.83,42.17 v1(16.9,42.17) ; USB1.A4 USB1.B9 16.67,37.3 v1(17.01,37.65)
VCC: length 142.3
  Bottom Layer w0.254: 96.94,10.98 C5.2 101.47,10.98 102.8,9.65 107.15,9.65 ; 96.94,10.98 U2.36 ; 96.94,10.98 94.61,10.98 ; U2.48 91.25,5.16 ; 91.25,5.16 90.93,5.48 90.93,6.96 ; 91.25,5.16 91.25,4.5 ; R1.2 105.76,8.25 107.15,9.65 ; U2.1 90.93,6.96 ; 90.93,6.96 90.93,7.3 ; 107.95,8.37 107.95,10.44 107.15,9.65 ; U2.24 90.1,15.87 90.65,16.42 ; 90.65,16.42 90.17,16.9 C6.2 ; 90.65,16.42 90.66,16.43 90.99,16.1 90.99,14.6 94.61,10.98 94.61,10.98 ; 33.38,14.22 33.38,8.77 41.01,1.14 102.62,1.14 107.95,6.47 107.95,7.93 ; 107.95,7.93 C9.2 ; 107.95,7.93 H1.1 ; 90.93,7.3 90.19,8.03 90.19,8.67 89.21,9.65 87.94,9.65 87.1,8.81 U2.9 86.31,8 85.46,8 ; 90.93,7.3 91.25,7.61 ; 94.61,10.98 91.26,7.62
BOOT0: length 3.8
  Bottom Layer w0.152: 96.15,4.69 U2.44
BOOT1: length 2.4
  Bottom Layer w0.152: R3.1 87.23,15.74 U2.20
CC1: length 7.3
  Bottom Layer w0.152: USB1.A5 14.62,38.3 13.71,37.4 13.71,33.71 14.09,33.33 R7.2
CC2: length 6.6
  Bottom Layer w0.152: USB1.B5 16.93,41.3 17.43,41.81 17.43,44.84 16.24,46.03
D+: length 10.1
  Bottom Layer w0.152: R5.1 103.69,12.43 102.14,13.99 95.84,13.99 94.89,13.04 U2.33
D-: length 9.8
  Bottom Layer w0.152: R4.1 102.93,13.71 102.3,14.34 95.48,14.34 U2.32
DN: length 19.3
  Bottom Layer w0.152: FPC4.3 16.5,51.5 17.79,50.21 17.79,40.07 17.01,39.3 ; USB1.A7 16.51,39.8 17.01,39.3 ; 17.01,39.3 16.52,38.8 USB1.B7
DP: length 17.1
  Bottom Layer w0.152: FPC4.2 13.2,52 12.44,52 12.06,51.62 12.06,42.22 14.47,39.81 ; USB1.B6 15.73,40.32 14.98,40.32 14.47,39.81 ; 14.47,39.81 14.98,39.3 USB1.A6
NET1: length 50.1
  Bottom Layer w0.152: FPC5.19 41.38,13.02 47.67,6.73 79.89,6.73 81.71,8.55 86.16,8.55 U2.10
NET2: length 49
  Bottom Layer w0.152: FPC5.20 41.88,13.12 47.89,7.11 79.7,7.11 81.59,9.01 85.91,9.01 U2.11
NET3: length 54
  Bottom Layer w0.152: U2.12 85.58,9.39 81.47,9.39 79.57,7.49 64.55,7.49 ; 64.55,7.49 48.01,7.49 42.38,13.13 FPC5.21 ; 64.55,7.49 62.19,9.85 U1.1
NET4: length 49.3
  Bottom Layer w0.152: FPC5.22 42.88,13.13 46.5,9.52 49.84,9.52 55.05,14.73 68.01,14.73 70.55,12.19 83.75,12.19 84.13,12.57 85.45,12.57 U2.13
NET5: length 49
  Bottom Layer w0.152: FPC5.23 43.38,13.14 46.62,9.9 49.72,9.9 54.92,15.11 68.13,15.11 70.67,12.57 83.63,12.57 84.01,12.95 85.78,12.95 U2.14
NET6: length 48.7
  Bottom Layer w0.152: FPC5.24 43.88,13.15 46.75,10.28 49.59,10.28 54.8,15.49 68.26,15.49 70.8,12.95 83.5,12.95 83.88,13.33 86.1,13.33 U2.15
NET7: length 49.2
  Bottom Layer w0.152: FPC5.25 44.38,13.16 46.88,10.66 49.46,10.66 56.07,17.27 79.17,17.27 D1.1 82.48,15.11 83.88,13.71 86.43,13.71 U2.16
NET8: length 48.9
  Bottom Layer w0.152: U2.17 86.76,14.09 84.13,14.09 80.58,17.65 55.94,17.65 49.34,11.04 47.01,11.04 44.88,13.17 FPC5.26
NET9: length 48.6
  Bottom Layer w0.152: U2.18 87.08,14.47 84.39,14.47 80.83,18.03 55.81,18.03 49.21,11.42 47.13,11.42 45.38,13.17 FPC5.27
NET10: length 48.3
  Bottom Layer w0.152: U2.19 87.41,14.85 84.64,14.85 81.09,18.41 55.69,18.41 49.08,11.8 47.26,11.8 45.88,13.18 FPC5.28
NET11: length 48.2
  Bottom Layer w0.152: FPC5.29 46.38,13.19 47.39,12.19 48.96,12.19 55.56,18.79 84.89,18.79 U2.21
NET12: length 47.9
  Bottom Layer w0.152: FPC5.30 46.88,13.2 47.51,12.57 48.83,12.57 55.43,19.17 85.21,19.17 U2.22
NET13: length 74.3
  Top Layer w0.152: v1(93.79,5.58) 89.85,9.52 83.25,9.52 75.63,1.9 v1(41.08,1.9)
  Bottom Layer w0.152: 33.88,14.22 33.88,9.1 v1(41.08,1.9) ; U2.46 93.79,5.65 v1(93.79,5.58)
NET14: length 75.7
  Top Layer w0.152: v1(41.08,2.66) 41.46,2.28 75.5,2.28 83.12,9.9 90.48,9.9 94.67,5.71 v1(94.67,5.33)
  Bottom Layer w0.152: 34.38,14.22 34.38,9.36 v1(41.08,2.66) ; U2.45 94.67,5.47 v1(94.67,5.33)
NET15: length 83.2
  Top Layer w0.152: v1(100.01,5.71) 100.01,8.76 96.58,12.19 82.36,12.19 74.74,4.57 43.75,4.57 v1(41.08,7.23)
  Bottom Layer w0.152: v1(41.08,7.23) 37.38,10.93 37.38,14.22 ; v1(100.01,5.71) 95.85,5.71 U2.43
NET16: length 81.6
  Top Layer w0.152: v1(41.08,6.47) 43.37,4.19 74.86,4.19 82.48,11.8 96.45,11.8 99.37,8.88 v1(99.37,6.34)
  Bottom Layer w0.152: 36.88,14.22 36.88,10.67 v1(41.08,6.47) ; 94.17,8.09 95.92,6.34 v1(99.37,6.34)
NET17: length 79.9
  Top Layer w0.152: v1(41.08,5.71) 42.99,3.8 74.99,3.8 82.61,11.42 96.33,11.42 98.74,9.01 v1(98.74,6.98)
  Bottom Layer w0.152: U2.41 95.99,6.98 v1(98.74,6.98) ; 36.38,14.22 36.38,10.41 v1(41.08,5.71)
NET18: length 78.2
  Top Layer w0.152: v1(98.1,7.61) 98.1,9.01 96.07,11.04 82.74,11.04 75.12,3.42 42.61,3.42 v1(41.08,4.95)
  Bottom Layer w0.152: v1(98.1,7.61) 96.06,7.61 U2.40 ; 35.88,14.22 35.88,10.15 v1(41.08,4.95)
NET19: length 76.5
  Top Layer w0.152: v1(41.08,4.19) 42.22,3.04 75.24,3.04 82.86,10.66 95.82,10.66 97.49,8.99 97.49,8.27 v1(97.47,8.25)
  Bottom Layer w0.152: v1(97.47,8.25) 96.13,8.25 U2.39 ; 35.38,14.22 35.38,9.89 v1(41.08,4.19)
NET20: length 74.7
  Top Layer w0.152: v1(96.83,8.88) 95.44,10.28 82.99,10.28 75.37,2.66 41.84,2.66 v1(41.08,3.42)
  Bottom Layer w0.152: v1(96.83,8.88) 96.21,8.88 95.59,9.5 ; 34.88,14.22 34.88,9.62 v1(41.08,3.42)
NET21: length 63.8
  Top Layer w0.152: v1(95.69,14.98) 81.59,14.98 73.85,7.23 46.42,7.23 v1(41.08,12.57)
  Bottom Layer w0.152: 40.88,14.22 40.88,12.77 v1(41.08,12.57) ; v1(95.69,14.98) 95.41,14.98 94.17,13.74
NET22: length 67.2
  Top Layer w0.152: v1(96.33,15.61) 96.35,15.59 96.35,14.88 95.92,14.45 81.57,14.45 73.97,6.85 46.03,6.85 v1(41.08,11.8)
  Bottom Layer w0.152: v1(41.08,11.8) 40.38,12.51 40.38,14.22 ; U2.30 95.34,15.61 v1(96.33,15.61)
NET23: length 70.5
  Top Layer w0.152: v1(96.96,16.25) 96.96,14.98 96.07,14.09 81.72,14.09 74.1,6.47 45.65,6.47 v1(41.08,11.04)
  Bottom Layer w0.152: v1(96.96,16.25) 95.27,16.25 U2.29 ; 39.88,14.22 39.88,12.24 v1(41.08,11.04)
NET24: length 73.8
  Top Layer w0.152: v1(97.6,16.89) 97.6,15.11 96.2,13.71 81.85,13.71 74.23,6.09 45.27,6.09 v1(41.08,10.28)
  Bottom Layer w0.152: U2.28 95.19,16.89 v1(97.6,16.89) ; 39.38,14.22 39.38,11.98 v1(41.08,10.28)
NET25: length 77
  Top Layer w0.152: v1(41.08,9.52) 44.89,5.71 74.36,5.71 81.98,13.33 96.33,13.33 98.23,15.23 v1(98.23,17.52)
  Bottom Layer w0.152: 38.88,14.22 38.88,11.72 v1(41.08,9.52) ; U2.27 95.12,17.52 v1(98.23,17.52)
NET26: length 80.3
  Top Layer w0.152: v1(41.08,8.76) 44.51,5.33 74.48,5.33 82.1,12.95 96.45,12.95 98.87,15.36 v1(98.87,18.16)
  Bottom Layer w0.152: 38.38,14.22 38.38,11.46 v1(41.08,8.76) ; U2.26 95.05,18.16 v1(98.87,18.16)
NET27: length 83.6
  Top Layer w0.152: v1(41.08,8) 44.13,4.95 74.61,4.95 82.23,12.57 96.58,12.57 99.5,15.49 v1(99.5,18.79)
  Bottom Layer w0.152: v1(99.5,18.79) 94.98,18.79 U2.25 ; 37.88,14.22 37.88,11.2 v1(41.08,8)
OSCIN: length 7.7
  Bottom Layer w0.152: X3.3 86.37,2.42 87.31,3.36 ; C2.1 87.31,3.36 87.31,6.17 88.77,7.63
OSCOUT: length 7.3
  Bottom Layer w0.152: U2.6 86.88,6.45 86.88,6.1 85.86,5.08 84.56,5.08 ; 84.56,5.08 83.92,4.45 X3.1 ; 84.56,5.08 83.76,5.88 C3.1
PRED+: length 6.9
  Bottom Layer w0.152: FPC3.3 108.39,14.12 106.45,12.19 105.35,12.19 R6.1 103.84,10.67 R5.2
PRED-: length 3.5
  Bottom Layer w0.152: R4.2 107.43,13.71 107.89,14.17 FPC3.2
RST: length 24.2
  Top Layer w0.152: v1(88.96,8.88) 89.72,8.12 v1(89.72,4.31)
  Bottom Layer w0.152: v1(88.96,8.88) 88.61,8.88 U2.7 ; v1(89.72,4.31) 90.61,3.42 99.69,3.42 SW1.2 SW1.1 103.45,5.78 104.21,6.54 R1.1
SWDCLK: length 15.7
  Top Layer w0.152: v1(101.28,9.52) 108.52,2.28
  Bottom Layer w0.152: U2.37 96.28,9.52 v1(101.28,9.52)
SWDIO: length 20.8
  Top Layer w0.152: v1(99.88,13.46) H1.2
  Bottom Layer w0.152: v1(99.88,13.46) 96.01,13.46 U2.34
$1N22067: length 3.9
  Bottom Layer w0.152: D1.2 75.12,15.11 U1.2

## Copper pours and planes (outline as drawn; the poured copper is in the pictures)
GND on Top Layer: 7.87,22.92 7.87,65.72 18.92,65.72 18.92,22.92
GND on Bottom Layer: 8,22.92 8,65.72 19.05,65.72 19.05,22.92
GND1 on Top Layer: 7.36,22.41 131.44,22.41 131.44,-2.86 7.36,-2.86
GND1 on Bottom Layer: 7.55,22.73 130.87,22.73 130.87,-2.55 7.55,-2.55
GND2 on Top Layer: 21.52,62.22 131.2,62.22 131.2,27.18 21.52,27.18
GND2 on Bottom Layer: 21.9,61.33 131.96,61.33 131.96,26.93 21.9,26.93

Small or netless copper shapes (teardrops, artwork), in the pictures only: 40 on Top Layer, 183 on Bottom Layer

## Text on the board
Bottom Silkscreen Layer: GND | SCK | SDO | VCC
Top Silkscreen Layer: v1.1.0 | JLCJLCJLCJLC
